# Altium schematic sheet POWER_STAGE_CHANNEL.SchDoc
size 420 x 297 mm; Author: P. Zdunek; CompanyName: WUT ISE; DrawnBy: P. Zdunek; Organization: WUT ISE; Address1: PW ISE; Address2: Nowowiejska 15/19 00-665 Warsaw; Address3: p.zdunek90@gmail.com; DocumentNumber: 5; Revision: 2; SheetNumber: 5; SheetTotal: 7; ModifiedBy: -; CheckedDate: -; Title2: Stage; DivGrp: WUT ISE; Designer: P. Zdunek; ModifiedDate: -; ProjectName: Sensor Box
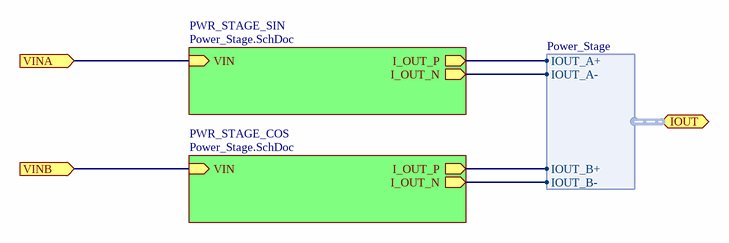
[diagram p0: POWER_STAGE_CHANNEL.SchDoc]

## Sub-sheets
PWR_STAGE_COS = Power_Stage.SchDoc: I_OUT_P (out), I_OUT_N (out), VIN (in)
PWR_STAGE_SIN = Power_Stage.SchDoc: I_OUT_P (out), I_OUT_N (out), VIN (in)

## Ports
IOUT (bidir, harness Power_Stage), VINA (in), VINB (in)

## Harnesses
Power_Stage: IOUT_A+, IOUT_A-, IOUT_B+, IOUT_B-

## Nets
VINA: port VINA, sheet PWR_STAGE_SIN/VIN
VINB: port VINB, sheet PWR_STAGE_COS/VIN
(unnamed): sheet PWR_STAGE_SIN/I_OUT_P, port IOUT.IOUT_A+
(unnamed): sheet PWR_STAGE_SIN/I_OUT_N, port IOUT.IOUT_A-
(unnamed): sheet PWR_STAGE_COS/I_OUT_P, port IOUT.IOUT_B+
(unnamed): sheet PWR_STAGE_COS/I_OUT_N, port IOUT.IOUT_B-

## Notes on the sheet
- Project/Equipment
- Document
- Designer
- Drawn by
- Check.by
- Copyright WUT ISE 2020.
  This documentation describes Open Hardware and is licensed under the CERN OHL v.1.2. You may redistribute and modify this documentation under the terms of the CERN OHL v.1.2. (http://ohwr.org/CERNOHL). This documentation is distributed WITHOUT ANY EXPRESS OR IMPLIED WARRANTY, INCLUDING OF MERCHANTABILITY, SATISFACTORY QUALITY AND FITNESS FOR A PARTICULAR PURPOSE. Please see the CERN OHL v.1.2 for applicable conditions.
- Contact
- File
- Last Mod.
- Print Date
- Sheet
- Size
- A3
- of
- Rev